# Altium schematic sheet S7_SDRAM.SchDoc
size A3
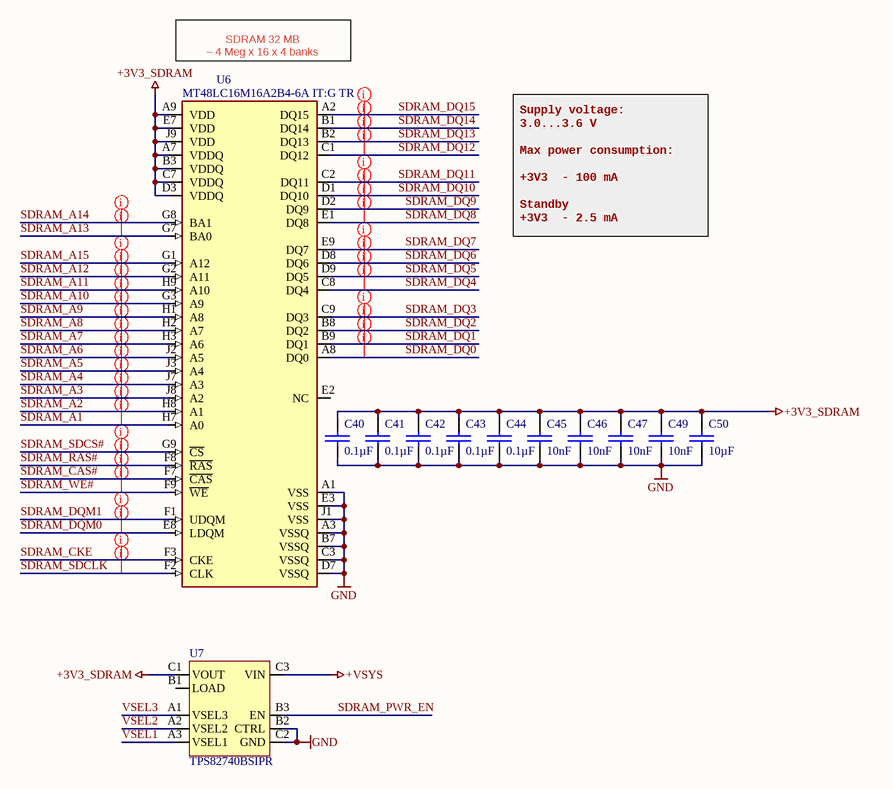
[diagram p0: S7_SDRAM.SchDoc]

## Parts
C40  value 0.1µF  [0402 CAP]  (hidden comment: 0402B104K500CT)
C41  value 0.1µF  [0402 CAP]  (hidden comment: 0402B104K500CT)
C42  value 0.1µF  [0402 CAP]  (hidden comment: 0402B104K500CT)
C43  value 0.1µF  [0402 CAP]  (hidden comment: 0402B104K500CT)
C44  value 0.1µF  [0402 CAP]  (hidden comment: 0402B104K500CT)
C45  value 10nF  [0402 CAP]  (hidden comment: CL05B103KB5NNNC)
C46  value 10nF  [0402 CAP]  (hidden comment: CL05B103KB5NNNC)
C47  value 10nF  [0402 CAP]  (hidden comment: CL05B103KB5NNNC)
C49  value 10nF  [0402 CAP]  (hidden comment: CL05B103KB5NNNC)
C50  value 10µF  [0603 CAP]  (hidden comment: GRT188R61C106KE13D)
U6  MT48LC16M16A2B4-6A IT:G TR  [MICRON_VFBGA54]
U7  TPS82740BSIPR  [MicroSiP]

## Nets
+3V3_SDRAM: C40.1 C41.1 C42.1 C43.1 C44.1 C45.1 C46.1 C47.1 C49.1 C50.1 U6.A7(VDDQ) U6.A9(VDD) U6.B3(VDDQ) U6.C7(VDDQ) U6.D3(VDDQ) U6.E7(VDD) U6.J9(VDD) U7.C1(VOUT)
+VSYS: U7.C3(VIN)
GND: C40.2 C41.2 C42.2 C43.2 C44.2 C45.2 C46.2 C47.2 C49.2 C50.2 U6.A1(VSS) U6.A3(VSSQ) U6.B7(VSSQ) U6.C3(VSSQ) U6.D7(VSSQ) U6.E3(VSS) U6.J1(VSS) U7.B2(CTRL) U7.C2(GND)
SDRAM_A1: U6.H7(A0)
SDRAM_A2: U6.H8(A1)
SDRAM_A3: U6.J8(A2)
SDRAM_A4: U6.J7(A3)
SDRAM_A5: U6.J3(A4)
SDRAM_A6: U6.J2(A5)
SDRAM_A7: U6.H3(A6)
SDRAM_A8: U6.H2(A7)
SDRAM_A9: U6.H1(A8)
SDRAM_A10: U6.G3(A9)
SDRAM_A11: U6.H9(A10)
SDRAM_A12: U6.G2(A11)
SDRAM_A13: U6.G7(BA0)
SDRAM_A14: U6.G8(BA1)
SDRAM_A15: U6.G1(A12)
SDRAM_CAS#: U6.F7(~{CAS})
SDRAM_CKE: U6.F3(CKE)
SDRAM_DQ0: U6.A8(DQ0)
SDRAM_DQ1: U6.B9(DQ1)
SDRAM_DQ2: U6.B8(DQ2)
SDRAM_DQ3: U6.C9(DQ3)
SDRAM_DQ4: U6.C8(DQ4)
SDRAM_DQ5: U6.D9(DQ5)
SDRAM_DQ6: U6.D8(DQ6)
SDRAM_DQ7: U6.E9(DQ7)
SDRAM_DQ8: U6.E1(DQ8)
SDRAM_DQ9: U6.D2(DQ9)
SDRAM_DQ10: U6.D1(DQ10)
SDRAM_DQ11: U6.C2(DQ11)
SDRAM_DQ12: U6.C1(DQ12)
SDRAM_DQ13: U6.B2(DQ13)
SDRAM_DQ14: U6.B1(DQ14)
SDRAM_DQ15: U6.A2(DQ15)
SDRAM_DQM0: U6.E8(LDQM)
SDRAM_DQM1: U6.F1(UDQM)
SDRAM_PWR_EN: U7.B3(EN)
SDRAM_RAS#: U6.F8(~{RAS})
SDRAM_SDCLK: U6.F2(CLK)
SDRAM_SDCS#: U6.G9(~{CS})
SDRAM_WE#: U6.F9(~{WE})
VSEL1: U7.A3(VSEL1)
VSEL2: U7.A2(VSEL2)
VSEL3: U7.A1(VSEL3)

Not connected (* = marked no-connect by the designer): U6 E2(NC); U7 B1(LOAD)

## Layout directives
net class SDRAM_D: SDRAM_DQ0, SDRAM_DQ1, SDRAM_DQ2, SDRAM_DQ3, SDRAM_DQ4, SDRAM_DQ5, SDRAM_DQ6, SDRAM_DQ7, SDRAM_DQ8, SDRAM_DQ9, SDRAM_DQ10, SDRAM_DQ11, SDRAM_DQ12, SDRAM_DQ13, SDRAM_DQ14, SDRAM_DQ15
net class SDRAM_A: SDRAM_A1, SDRAM_A2, SDRAM_A3, SDRAM_A4, SDRAM_A5, SDRAM_A6, SDRAM_A7, SDRAM_A8, SDRAM_A9, SDRAM_A10, SDRAM_A11, SDRAM_A12, SDRAM_A13, SDRAM_A14, SDRAM_A15
net class SDRAM_C: SDRAM_CAS#, SDRAM_CKE, SDRAM_DQM0, SDRAM_DQM1, SDRAM_RAS#, SDRAM_SDCLK, SDRAM_SDCS#, SDRAM_WE#

## Notes on the sheet
- SDRAM 32 MB
  – 4 Meg x 16 x 4 banks
- Supply voltage:
  3.0...3.6 V
  Max power consumption:
  +3V3  - 100 mA
  Standby
  +3V3  - 2.5 mA

## Library data of the parts
C40-C44 = 0402B104K500CT: 0.1µF, ±10%, 50V, X7R, 0402 (1005 Metric), -55°C ~ 125°C, -, General Purpose; Manufacturer: Walsin Technology Corporation; PartNum: 1292-1176-1-ND; Voltage - Rated: 50V; Part Number: 0402B104K500CT; Distributor: Digi-Key; PartName: 0402B104K500CT; Price: 0.19000; Tolerance: ±10%; Temperature Coefficient: X7R; Operating Temperature: -55°C ~ 125°C; Features: -; Package / Case: 0402 (1005 Metric)
C45-C47 C49 = CL05B103KB5NNNC: 10000pF, ±10%, 50V, X7R, 0402 (1005 Metric), -55°C ~ 125°C, -, General Purpose; Manufacturer: Samsung Electro-Mechanics; PartNum: 1276-1028-1-ND; Voltage - Rated: 50V; Part Number: CL05B103KB5NNNC; Distributor: Digi-Key; PartName: CL05B103KB5NNNC; Price: 0.10000; Tolerance: ±10%; Temperature Coefficient: X7R; Operating Temperature: -55°C ~ 125°C; Features: -; Package / Case: 0402 (1005 Metric)
C50 = GRT188R61C106KE13D: 10µF, ±10%, 16V, X5R, 0603 (1608 Metric), -55°C ~ 85°C, -, Automotive; Manufacturer: Murata Electronics North America; PartNum: 490-12317-1-ND; Voltage - Rated: 16V; Part Number: GRT188R61C106KE13D; Distributor: Digi-Key; PartName: GRT188R61C106KE13D; Price: 0.22770; Tolerance: ±10%; Temperature Coefficient: X5R; Operating Temperature: -55°C ~ 85°C; Features: -; Package / Case: 0603 (1608 Metric)
U6 = MT48LC16M16A2B4-6A IT:G TR: Micron SDRAM 256M-Bit 16Mx16, 3.3V, 167MHz, 6ns, -40°C ~ +85°C, 54-VFBGA (8x8) Pb-free; Manufacturer: Micron Technology Inc.; PartNum: 340-128306-REEL; Distributor: Mouser; PartName: MT48LC16M16A2B4-6A IT:G TR; Price: 8$
U7 = TPS82740BSIPR: Non-Isolated PoL Module DC DC Converter 1 Output 2.6 ~ 3.3V 200mA 2.2V - 5.5V Input, 3.0mm x 2.4mm x 1.0mm, -40...85 C; Manufacturer: Texas Instruments; PartNum: 296-46481-1-ND; Distributor: Digi-Key; price: 2.88$; PartName: TPS82740BSIPR